# Altium schematic sheet AMS_Sheet1.SchDoc
size A4; SheetNumber: 7; SheetTotal: 11
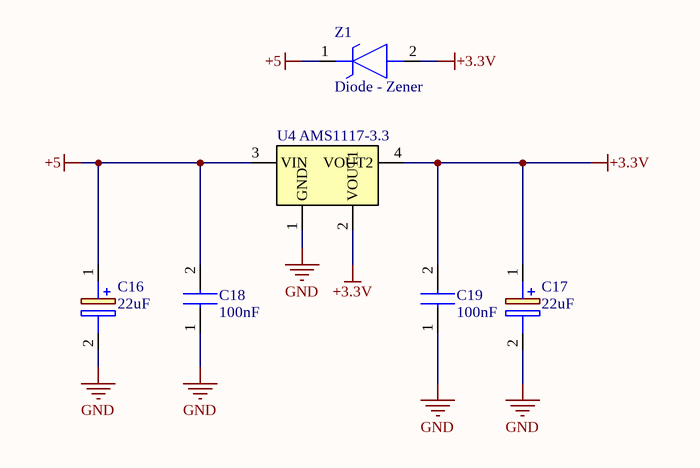
[diagram p0: AMS_Sheet1.SchDoc]

## Parts
C16  22uF  [CAPP_Lytic_D_6.6]
C17  22uF  [CAPP_Lytic_D_6.6]
C18  100nF  [CAP - 0603]
C19  100nF  [CAP - 0603]
U4  AMS1117-3.3  [SOT-223 - AMS1117-3.3]
Z1  Diode - Zener  [SOD-80 (MINIMELF)]

## Nets
+3.3V: C17.1(+) C19.2 U4.2(VOUT1) U4.4(VOUT2) Z1.2(A)
+5: C16.1(+) C18.2 U4.3(VIN) Z1.1(K)
GND: C16.2(-) C17.2(-) C18.1 C19.1 U4.1(GND)

## Library data of the parts
C16 C17 = Cap - Pol: Capacitor Polarised; ComponentLink1Description: Satın Alma Linki; ComponentLink1URL: https://ozdisan.com/pasif-komponentler/kondansatorler/aluminyum-kondansatorler/BDS35VC220MH10TP; ComponentLink2Description: Satın Alma Linki; ComponentLink2URL: https://ozdisan.com/pasif-komponentler/kondansatorler/aluminyum-kondansatorler/SC1H226M6L005VR; ComponentLink3Description: Satın Alma Linki; ComponentLink3URL: https://ozdisan.com/pasif-komponentler/kondansatorler/aluminyum-kondansatorler/BDA50VC10MF55TP; ComponentLink4Description: Datasheet; ComponentLink4URL: https://cdn.ozdisan.com/ETicaret_Dosya/455406_6857235.pdf
C18 C19 = CAP: Capacitor; ComponentLink1Description: Satın Alma Linki; ComponentLink1URL: https://ozdisan.com/pasif-komponentler/kondansatorler/smt-smd-ve-mlcc-kondansatorler/CL10B472KB8NNNC; ComponentLink2Description: Satın Alma Linki; ComponentLink2URL: https://ozdisan.com/pasif-komponentler/kondansatorler/smt-smd-ve-mlcc-kondansatorler/CL10C200JB8NNNC; ComponentLink3Description: Satın Alma Linki; ComponentLink3URL: https://ozdisan.com/pasif-komponentler/kondansatorler/smt-smd-ve-mlcc-kondansatorler/CL10B104KB8NNNC; ComponentLink4Description: Datasheet; ComponentLink4URL: https://cdn.ozdisan.com/ETicaret_Dosya/448212_5798276.PDF; ComponentLink5Description: Satın Alma Linki; ComponentLink5URL: https://ozdisan.com/pasif-komponentler/kondansatorler/smt-smd-ve-mlcc-kondansatorler/CL10C101JB8NNNC
U4 = AMS1117-3.3: Manufacturer_Name: Advanced Monolithic Systems; Datasheet Link: http://www.advanced-monolithic.com/pdf/ds1117.pdf; Height: 1.8mm; Manufacturer_Part_Number: AMS1117-3.3; ComponentLink1Description: Satın Alma Linki; ComponentLink1URL: https://ozdisan.com/entegre-devreler-ics/guc-entegreleri/lineer-voltaj-regulatorleri/AMS1117-3-3
Z1 = Diode - Zener: Zener Diode; ComponentLink1Description: Satın Alma Linki; ComponentLink1URL: https://www.ozdisan.com/guc-yari-iletkenleri/diyotlar-modul-diyotlar-ve-dogrultucular/zener-diyotlar/ZMM55C3V3-HT; ComponentLink2Description: Datasheet; ComponentLink2URL: https://cdn.ozdisan.com/ETicaret_Dosya/417232_6139407.pdf